# Altium project Chassis.PrjPcb
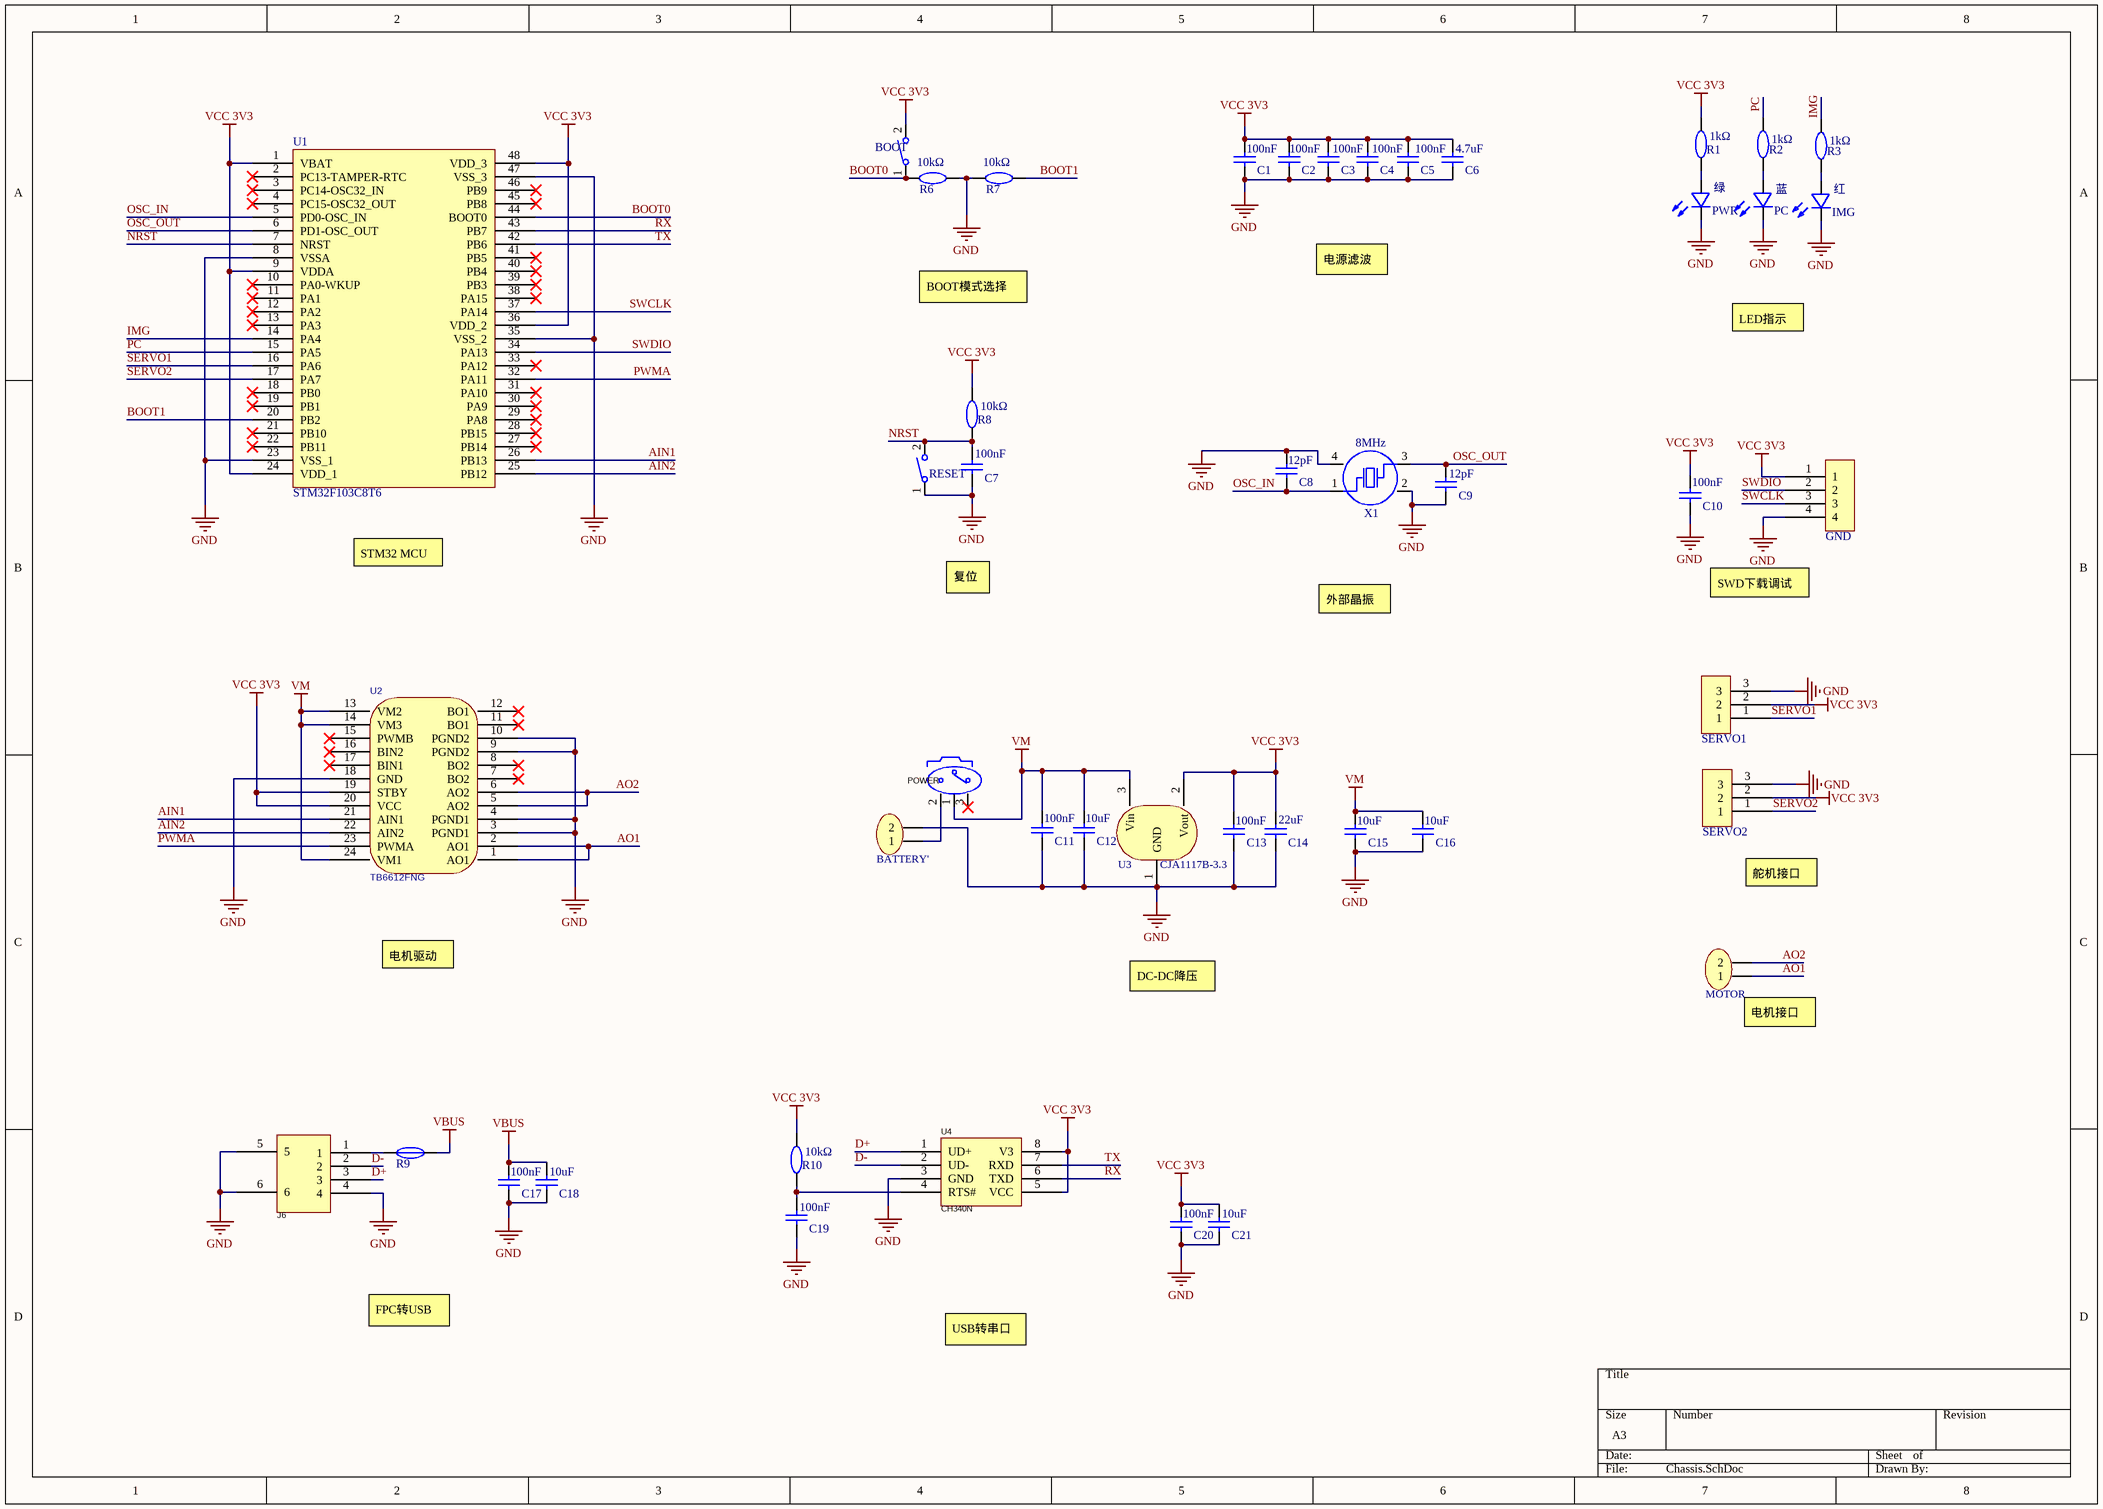
[diagram p0: Chassis.SchDoc]
1 sheet, 46 parts. Net scope: global (net labels, ports and power ports of the same name join across sheets).
Board files: Chassis_V1.PcbDoc, Chassis_V2.PcbDoc

## Sheet Chassis.SchDoc
size A3

### Parts
BATTERY'  PH2.0-2pin  [CONN-TH_2P-P2.00_GP01-2001WR-2P]  (value not drawn)
BOOT  Switch  [KEY-SMD_2P-L6.0-W3.6-P7.4-LS8.0-L]  (value not drawn)
C1  CAP-0402  [C0402]  (value not drawn)
C2  CAP-0402  [C0402]  (value not drawn)
C3  CAP-0402  [C0402]  (value not drawn)
C4  CAP-0402  [C0402]  (value not drawn)
C5  CAP-0402  [C0402]  (value not drawn)
C6  CAP-0402  [C0402]  (value not drawn)
C7  CAP-0402  [C0402]  (value not drawn)
C8  CAP-0402  [C0402]  (value not drawn)
C9  CAP-0402  [C0402]  (value not drawn)
C10  CAP-0402  [C0402]  (value not drawn)
C11  CAP-0402  [C0402]  (value not drawn)
C12  CAP-0402  [C0402]  (value not drawn)
C13  CAP-0402  [C0402]  (value not drawn)
C14  CAP-0402  [C0402]  (value not drawn)
C15  CAP-0402  [C0402]  (value not drawn)
C16  CAP-0402  [C0402]  (value not drawn)
C17  CAP-0402  [C0402]  (value not drawn)
C18  CAP-0402  [C0402]  (value not drawn)
C19  CAP-0402  [C0402]  (value not drawn)
C20  CAP-0402  [C0402]  (value not drawn)
C21  CAP-0402  [C0402]  (value not drawn)
GND  HDR-1X4  [HDR-TH_4P-P2.54-H-M-W10.4]  (value not drawn)
IMG  LED0805-RD  [LED0805-RD]  (value not drawn)
J6  AFC01-S04FCC-00  [FFC-SMD_4P-P0.50_AFC01-S04FCC-00]  (value not drawn)
MOTOR  PH2.0-2pin  [CONN-TH_2P-P2.00_GP01-2001WR-2P]  (value not drawn)
PC  LED0805-RD  [LED0805-RD]  (value not drawn)
POWER  BSI-10H  [SW-TH_BSI-10H]  (value not drawn)
PWR  LED0805-RD  [LED0805-RD]  (value not drawn)
R1  RES-0402  [R0402]  (value not drawn)
R2  RES-0402  [R0402]  (value not drawn)
R3  RES-0402  [R0402]  (value not drawn)
R6  RES-0402  [R0402]  (value not drawn)
R7  RES-0402  [R0402]  (value not drawn)
R8  RES-0402  [R0402]  (value not drawn)
R9  TLC F1206  [F1206]  (value not drawn)
R10  RES-0402  [R0402]  (value not drawn)
RESET  Switch  [KEY-SMD_2P-L6.0-W3.6-P7.4-LS8.0-L]  (value not drawn)
SERVO1  MX1.25-3pin  [CONN-TH_3P-P1.25_BX-MX1.25-3PWZ]  (value not drawn)
SERVO2  MX1.25-3pin  [CONN-TH_3P-P1.25_BX-MX1.25-3PWZ]  (value not drawn)
U1  STM32F103C8T6  [LQFP-48_L7.0-W7.0-P0.50-LS9.0-BL]
U2  TB6612FNG  [SSOP-24_L8.4-W5.8-P0.65-LS7.8-BL]
U3  CJA1117B-3.3  [SOT-89]
U4  CH340N  [SOP-8_L4.9-W3.9-P1.27-LS6.0-BL]
X1  OSC CRYSTAL-SMD_4P-L3.2-W2.5-BL  [CRYSTAL-SMD_4P-L3.2-W2.5-BL]  (value not drawn)

### Nets
GND: BATTERY'.2 C1.1 C2.1 C3.1 C4.1 C5.1 C6.1 C7.1 C8.2 C9.1 C10.1 C11.1 C12.1 C13.1 C14.1 C15.1 C16.1 C17.1 C18.1 C19.1 C20.1 C21.1 GND.4 IMG.1(-) J6.4 J6.5 J6.6 PC.1(-) PWR.1(-) R6.2 R7.1 RESET.1 SERVO1.3 SERVO2.3 U1.8(VSSA) U1.23(VSS_1) U1.35(VSS_2) U1.47(VSS_3) U2.3(PGND1) U2.4(PGND1) U2.9(PGND2) U2.10(PGND2) U2.18(GND) U3.1(GND) U4.3(GND) X1.2(GND) X1.4(GND)
VBUS: C17.2 C18.2 R9.2
VCC 3V3: BOOT.2 C1.2 C2.2 C3.2 C4.2 C5.2 C6.2 C10.2 C13.2 C14.2 C20.2 C21.2 GND.1 R1.2 R8.2 R10.2 SERVO1.2 SERVO2.2 U1.1(VBAT) U1.9(VDDA) U1.24(VDD_1) U1.36(VDD_2) U1.48(VDD_3) U2.19(STBY) U2.20(VCC) U3.2(Vout) U4.5(VCC) U4.8(V3)
VM: C11.2 C12.2 C15.2 C16.2 POWER.1 U2.13(VM2) U2.14(VM3) U2.24(VM1) U3.3(Vin)
AIN1: U1.26(PB13) U2.21(AIN1)
AIN2: U1.25(PB12) U2.22(AIN2)
AO1: MOTOR.1 U2.1(AO1) U2.2(AO1)
AO2: MOTOR.2 U2.5(AO2) U2.6(AO2)
BOOT0: BOOT.1 R6.1 U1.44(BOOT0)
BOOT1: R7.2 U1.20(PB2)
D+: J6.3 U4.1(UD+)
D-: J6.2 U4.2(UD-)
IMG: R3.2 U1.14(PA4)
NRST: C7.2 R8.1 RESET.2 U1.7(NRST)
OSC_IN: C8.1 U1.5(PD0-OSC_IN) X1.1(OSC1)
OSC_OUT: C9.2 U1.6(PD1-OSC_OUT) X1.3(OSC2)
PC: R2.2 U1.15(PA5)
PWMA: U1.32(PA11) U2.23(PWMA)
RX: U1.43(PB7) U4.6(TXD)
SERVO1: SERVO1.1 U1.16(PA6)
SERVO2: SERVO2.1 U1.17(PA7)
SWCLK: GND.3 U1.37(PA14)
SWDIO: GND.2 U1.34(PA13)
TX: U1.42(PB6) U4.7(RXD)
NetBATTERY'_1: BATTERY'.1 POWER.2
NetC19_2: C19.2 R10.1 U4.4(RTS#)
NetIMG_2: IMG.2(+) R3.1
NetJ6_1: J6.1 R9.1
NetPC_2: PC.2(+) R2.1
NetPWR_2: PWR.2(+) R1.1

Not connected (* = marked no-connect by the designer): POWER 3*; U1 2(PC13-TAMPER-RTC)* 3(PC14-OSC32_IN)* 4(PC15-OSC32_OUT)* 10(PA0-WKUP)* 11(PA1)* 12(PA2)* 13(PA3)* 18(PB0)* 19(PB1)* 21(PB10)* 22(PB11)* 27(PB14)* 28(PB15)* 29(PA8)* 30(PA9)* 31(PA10)* 33(PA12)* 38(PA15)* 39(PB3)* 40(PB4)* 41(PB5)* 45(PB8)* 46(PB9)*; U2 7(BO2)* 8(BO2)* 11(BO1)* 12(BO1)* 15(PWMB)* 16(BIN2)* 17(BIN1)*

### Notes on the sheet
- 10kΩ
- (near R7) 10kΩ
- (near C1) 100nF
- (near C2) 100nF
- 100nF
- (near C6) 4.7uF
- (near R1) 1kΩ
- (near R2) 1kΩ
- (near R3) 1kΩ
- (near PWR) 绿
- (near PC) 蓝
- (near IMG) 红
- BOOT模式选择
- 电源滤波
- LED指示
- (near R8) 10kΩ
- (near X1) 8MHz
- (near C7) 100nF
- (near C8) 12pF
- (near C9) 12pF
- (near C10) 100nF
- STM32 MCU
- 复位
- 外部晶振
- SWD下载调试
- (near C11) 100nF
- (near C12) 10uF
- (near C13) 100nF
- (near C14) 22uF
- (near C15) 10uF
- (near C16) 10uF
- (near SERVO2) 舵机接口
- 电机驱动
- DC-DC降压
- (near MOTOR) 电机接口
- (near C18) 10uF
- (near R10) 10kΩ
- (near C19) 100nF
- (near C21) 10uF
- FPC转USB
- USB转串口

### Library data of the parts
BATTERY' MOTOR = PH2.0-2pin: PH2.0-2pin公头端子; BOM名称: 2P接插件; 封装库来自淘宝卖家 ID：黄晶宝石: 其他店铺购入均为盗版假冒封装库; 联系卖家，免费查找封装: 唯一出售店铺网址https://shop463601444.taobao.com
BOOT RESET = Switch: 滑动开关; Manufacturer: XKB Connectivity(中国星坤); Symbol: TS-1101-B-W; Device: TS-1101-B-W_C500065; Add into BOM: yes; Contact Current: 50mA; Voltage Rating (DC): 12V; Circuit: 单刀单掷; Actuator Style: 矩形按钮; Actuator/Cap Color: 白色; With Lamp: 无; Operating Force: 160gf; Mechanical Life: 5万次; Switch Length: 6mm; Switch Width: 3.6mm; Switch Height: 2.5mm; Strike Gundam: 否; LCSC Part Name: 6*3.6*2.5mm 立贴 轻触开关; Supplier Part: C500065; Manufacturer Part: TS-1101-B-W; Supplier Footprint: SMD; JLCPCB Part Class: 扩展库; Datasheet: https://atta.szlcsc.com/upload/public/pdf/source/20211011/D0E0CAF534F7B19DDE4CE68748A25BD3.pdf; Supplier: LCSC; Convert to PCB: yes; Insulation Resistance: -; Mounting Style: 立贴; Operating Temperature: -30℃~+85℃
C1-C21 = CAP-0402: 0402贴片电容; Manufacturer: SAMSUNG(三星); Symbol: CL21B104KBCNNNC; Add into BOM: yes; Tolerance: ±10%; Voltage Rated: 50V; Temperature Coefficient: X7R; Device: CL21B104KBCNNNC; LCSC Part Name: 100nF ±10% 50V; Supplier Part: C1711; Manufacturer Part: CL21B104KBCNNNC; Supplier Footprint: 0805; JLCPCB Part Class: Extended Part; Datasheet: https://atta.szlcsc.com/upload/public/pdf/source/20160103/1457707693305.pdf; Supplier: LCSC; Convert to PCB: yes
GND = HDR-1X4-弯排针: 1X4弯排针; Symbol: PZ254V-11-04P; Device: HDR-M_2.54_1x4P; Convert to PCB: yes; Add into BOM: yes; Supplier Part: C2935929; Supplier Footprint: 插件
IMG PC PWR = LED0805-RD: LED; Manufacturer: MEIHUA(美华科技); Symbol: MHT170UBCT; Add into BOM: yes; Lens Color: 无色透明; Dominant Wavelength: 460nm~475nm; Peak Wavelength: 468nm; Forward Current: 20mA; Forward Voltage (VF): 3.3V; Luminous Intensity: 225mcd; Power Dissipation: 95mW; Viewing Angle: 140°; Device: MHT170UBCT; LCSC Part Name: LED贴片0805超高亮蓝光; Supplier Part: C389525; Manufacturer Part: MHT170UBCT; Supplier Footprint: 0805; JLCPCB Part Class: Extended Part; Datasheet: https://atta.szlcsc.com/upload/public/pdf/source/20190515/C389525_9DDE5770D44EFFE682D3E1E38A61D6F4.pdf; Supplier: LCSC; Convert to PCB: yes; Diode Configuration: -; Color Temperature: -; Luminous Flux (@25℃): -; Mounting Sytle: -; Operating Temperature: -40~+85
J6 = FPC0.5-4pin: 4pin FPC接口，间距0.5mm; Manufacturer: JS(钜硕电子); Add into BOM: yes; Locking Feature: 翻盖式; Number of Contacts: 4P; Pitch: 0.5mm; FFC, FCB Thickness: 0.3mm; Symbol: AFC01-S04FCC-00; Device: AFC01-S04FCC-00; LCSC Part Name: 间距:0.5mm P数:4P 翻盖式 下接; Supplier Part: C262260; Manufacturer Part: AFC01-S04FCC-00; Supplier Footprint: SMD,P=0.5mm,卧贴; JLCPCB Part Class: Extended Part; Datasheet: https://atta.szlcsc.com/upload/public/pdf/source/20190816/C413942_2A72D1AC756EAE17EEDF756A339D4500.pdf; Supplier: LCSC; Convert to PCB: yes; Contact Type: 下接; Mounting Type: 卧贴; Height Above Board: 2mm
POWER = Switch-三脚开关: 三脚开关; Manufacturer: SM Switch; Symbol: BSI-10H_C5775777; Add into BOM: yes; Current Rating (DC): 50mA; Voltage Rating (DC): 12V; Device: BSI-10H_C5775777; LCSC Part Name: BSI-10H; Supplier Part: C5775777; Manufacturer Part: BSI-10H; Supplier Footprint: 插件; JLCPCB Part Class: Extended Part; Datasheet: https://atta.szlcsc.com/upload/public/pdf/source/20230506/E6C7D73CE6DA310EE0253B6F4CD83EFB.pdf; Supplier: LCSC; Convert to PCB: yes; Operating Temperature: -40℃~+85℃
R1-R3 R6-R8 R10 = RES-0402: 0402贴片电阻; Manufacturer: FH(风华); Symbol: RS-05K102JT; Add into BOM: yes; Tolerance: ±5%; Power(Watts): 125mW; Temperature Coefficient: ±100ppm/; Overload Voltage (Max): 150V; Device: RS-05K102JT; LCSC Part Name: 1kΩ ±5%; Supplier Part: C115302; Manufacturer Part: RS-05K102JT; Supplier Footprint: 0805; JLCPCB Part Class: Extended Part; Datasheet: https://atta.szlcsc.com/upload/public/pdf/source/20170704/1499151304704.pdf; Supplier: LCSC; Convert to PCB: yes; Operating Temperature Range: -55~+155
R9 = TLC F1206: 保险丝; Manufacturer: TLC(竞沃); Symbol: TLC-NSMD100; Add into BOM: yes; Operating Voltage (Max): 6V; Current Rating (Max): 100A; Hold Current: 1A; Trip Current: 2A; Power Dissipation: 600mW; Maximum Time to Trip: 100ms; Device: TLC-NSMD100; LCSC Part Name: 6V 1A 自恢复; Supplier Part: C261954; Manufacturer Part: TLC-NSMD100; Supplier Footprint: 1206; JLCPCB Part Class: Extended Part; Datasheet: https://atta.szlcsc.com/upload/public/pdf/source/20180802/C261954_CE31CE21EEB143DB51778C363DF0F083.pdf; Supplier: LCSC; Convert to PCB: yes; Resistance - Initial (Ri) (Min): -; Resistance - Post Trip (R1) (Max): -; Operating Temperature: -40~+85
SERVO1 SERVO2 = MX1.25-3pin: MX1.25 3pin 公头端子; Symbol: PZ254V-11-03P_C2937625; Device: HDR-M_2.54_1x3P; Convert to PCB: yes; Add into BOM: yes; Supplier Part: C2937625; Supplier Footprint: 插件
U1 = STM32F103C8T6: STM32F103C8T6 MCU; Manufacturer: ST(意法半导体); Add into BOM: yes; CPU Core: CM3; Program Storage Size: 64KB; RAM Size: 20KB; GPIO Ports Number: 37; Operating Voltage Range: 2V~3.6V; CPU Maximum Speed: 72MHz; Program Memory Type: FLASH; ADC (Bit): 12bit; Universal Serial Bus: 有; Peripheral/Function: 看门狗；DMA；看门狗；片载温度传感器; Symbol: STM32F103C8T6; LCSC Part Name: STM32F103C8T6 MSL=3; Supplier Part: C8734; Manufacturer Part: STM32F103C8T6; Supplier Footprint: LQFP-48(7x7); JLCPCB Part Class: 扩展库; Datasheet: https://atta.szlcsc.com/upload/public/pdf/source/20220812/8363ACEC51AD55ECEB84799464F7CB85.pdf; Supplier: LCSC; Convert to PCB: yes; Operating Temperature Range: -40℃~+85℃; DAC (Bit): -; PWM (Bit): -; Internal Comparator: -; communication protocol: -; Watchdog: 有; Real-Time Clock: -; Infrared Data Association: 有; Low-Voltage Detect: 有; CCP Capture/Compare: -; Secure Digital Input and Output: -; Direct Memory Access: 有; Internal Oscillator: 有; Device: STM32F103C8T6
U2 = TB6612FNG: TB6612FNG电机驱动; 联系卖家，免费查找封装: 唯一出售店铺网址https://shop463601444.taobao.com; BOM名称: TB6612FNG
U3 = CJA1117B-3.3: 3.3V线性稳压器
U4 = CH340N: USB转串口; Manufacturer: WCH(南京沁恒); Symbol: CH340N_C2977777; Add into BOM: yes; Protocol: USB 2.0; Number of Channels: 1; Supply Voltage: 3.3V；5V; Data Rate: 2Mbps; Device: CH340N; LCSC Part Name: USB转串口芯片CH340; Supplier Part: C2977777; Manufacturer Part: CH340N; Supplier Footprint: SOP-8; JLCPCB Part Class: Extended Part; Datasheet: https://atta.szlcsc.com/upload/public/pdf/source/20240313/115CDE92081B1D6CB446704AD5D0F5F2.pdf; Supplier: LCSC; Convert to PCB: yes; Applications Function: USB转串口; Operating Temperature: -20℃~+70℃
X1 = OSC CRYSTAL-SMD_4P-L3.2-W2.5-BL: 四脚晶振; Manufacturer: JGHC(晶光华); Symbol: S3212000201080; Add into BOM: yes; Crystal Type: 贴片无源晶振; Frequency Tolerance: ±10ppm; Load Capacitance: 20pF; Equivalent Series Resistance (ESR): 80Ω; Device: S3212000201080; LCSC Part Name: 12MHz ±10ppm 20pF; Supplier Part: C426972; Manufacturer Part: S3212000201080; Supplier Footprint: SMD3225-4P; JLCPCB Part Class: Extended Part; Datasheet: https://atta.szlcsc.com/upload/public/pdf/source/20191012/C426972_E2C41F8C78BF72E52773F7737EA32F83.pdf; Supplier: LCSC; Convert to PCB: yes; Frequency Stability: -; Operating Temperature: -40~+85